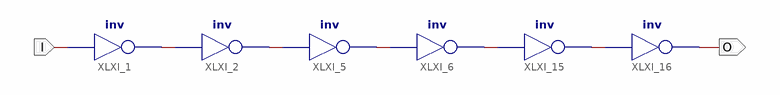
[diagram p0: schematic sheet 1]
// Xilinx ISE schematic delay.sch (virtex6) as structural Verilog: 6 symbols, 2 ports
module delay (
  input  I,
  output O
);

  wire XLXN_1, XLXN_3, XLXN_4, XLXN_11, XLXN_12;

  not XLXI_1 (XLXN_1, I);
  not XLXI_2 (XLXN_3, XLXN_1);
  not XLXI_5 (XLXN_4, XLXN_3);
  not XLXI_6 (XLXN_11, XLXN_4);
  not XLXI_15 (XLXN_12, XLXN_11);
  not XLXI_16 (O, XLXN_12);
endmodule
